# Altium project RPX_Regulator_5V.PrjPcb
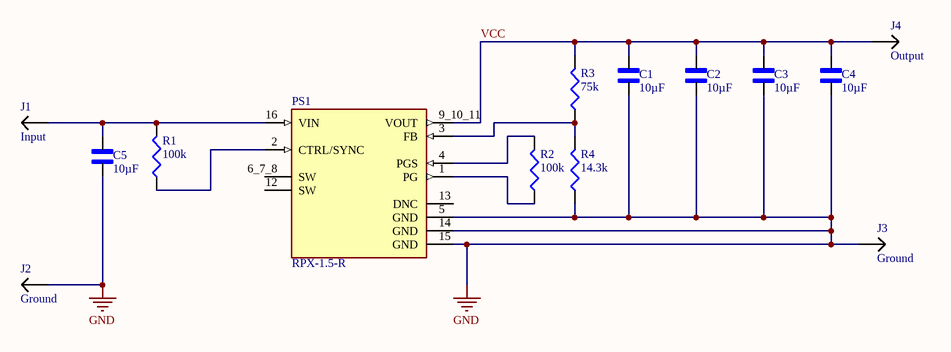
[diagram p0: RPX_Regulator_5V.SchDoc]
1 sheet, 14 parts. Net scope: global (net labels, ports and power ports of the same name join across sheets).
Board file: RPX_Regulator_5V.PcbDoc

## Sheet RPX_Regulator_5V.SchDoc: RPX_Regulator_5V
size A4; DrawnBy: Seif Farag; DocumentNumber: P2; Revision: 1.1.1; SheetNumber: 1; SheetTotal: 1

### Parts
C1  value 10µF  [CAPC1608X90N]  (hidden comment: C1608X7R1H474K080AC)
C2  value 10µF  [CAPC1608X90N]  (hidden comment: C1608X7R1H474K080AC)
C3  value 10µF  [CAPC1608X90N]  (hidden comment: C1608X7R1H474K080AC)
C4  value 10µF  [CAPC1608X90N]  (hidden comment: C1608X7R1H474K080AC)
C5  value 10µF  [CAPC1608X90N]  (hidden comment: C1608X7R1H474K080AC)
J1  Input  [PAD]
J2  Ground  [PAD]
J3  Ground  [PAD]
J4  Output  [PAD]
PS1  RPX-1.5-R  [CONV_RPX-1.5-R]
R1  value 100k  [J1-0603]  (hidden comment: RC0603FR-0710KL)
R2  value 100k  [J1-0603]  (hidden comment: RC0603FR-0710KL)
R3  value 75k  [J1-0603]  (hidden comment: RC0603FR-0710KL)
R4  value 14.3k  [J1-0603]  (hidden comment: RC0603FR-0710KL)

### Nets
GND: C1.1 C2.1 C3.1 C4.1 C5.1 J2.1 J3.1 PS1.5(GND) PS1.14(GND) PS1.15(GND) R4.1
VCC: C1.2 C2.2 C3.2 C4.2 J4.1 PS1.9_10_11(VOUT) R3.2
NetC5_2: C5.2 J1.1 PS1.16(VIN) R1.2
NetPS1_1: PS1.1(PG) R2.1
NetPS1_2: PS1.2(CTRL/SYNC) R1.1
NetPS1_3: PS1.3(FB) R3.1 R4.2
NetPS1_4: PS1.4(PGS) R2.2

Not connected (* = marked no-connect by the designer): PS1 6_7_8(SW) 12(SW) 13(DNC)

### Library data of the parts
C1-C5 = C1608X7R1H474K080AC: 0.47µF ±10% 50V Ceramic Capacitor X7R 0603 _1608 Metric_; MF: TDK; Price: None; Package: 0603 (1608) TDK; SnapEDA_Link: https://www.snapeda.com/parts/C1608X7R1H474K080AC/TDK/view-part/360155/?ref=snap; Availability: Unavailable; MP: C1608X7R1H474K080AC; ChipDip_Link: https://www.chipdip.ru/product0/8576565346
J1-J4 = PAD: Header 1; System: Connector; MF: Connfly electronic (Zhenqin); MP: PLS-3 (DS1021-1x3); Type: SMD; ChipDip_Link: https://www.chipdip.ru/product/pls-3; HelpURL: https://static.chipdip.ru/lib/227/DOC000227157.pdf
PS1 = RPX-1.5-R: MF: {'manufacturer': u'Recom Power'}; Package: None; Availability: Unavailable; Value: *; MP: RPX-1.5-R; Price: None
R1-R4 = RC0603FR-0710KL: 10 kOhms 1 0.1 W 1 10 W Chip Resistor 0603 1608 Metric Thick Film; Pacage Metric: 1608; MF: Yageo or NXP; MP: 10K 1% 0603; ChipDip_Link: https://www.chipdip.ru/product0/9000079736; HelpURL: https://www.chipdip.ru/product0/9000079736; Package: R0603; Type: SMD; SnapEDA_Link: https://www.snapeda.com/parts/RC0603FR-0710KL/Yageo/view-part/?ref=dk&t=RC0603FR-0710KL&con_ref=None